# EAGLE design quad-hybrid-QCN-xxx+ (EAGLE 9.5.1)
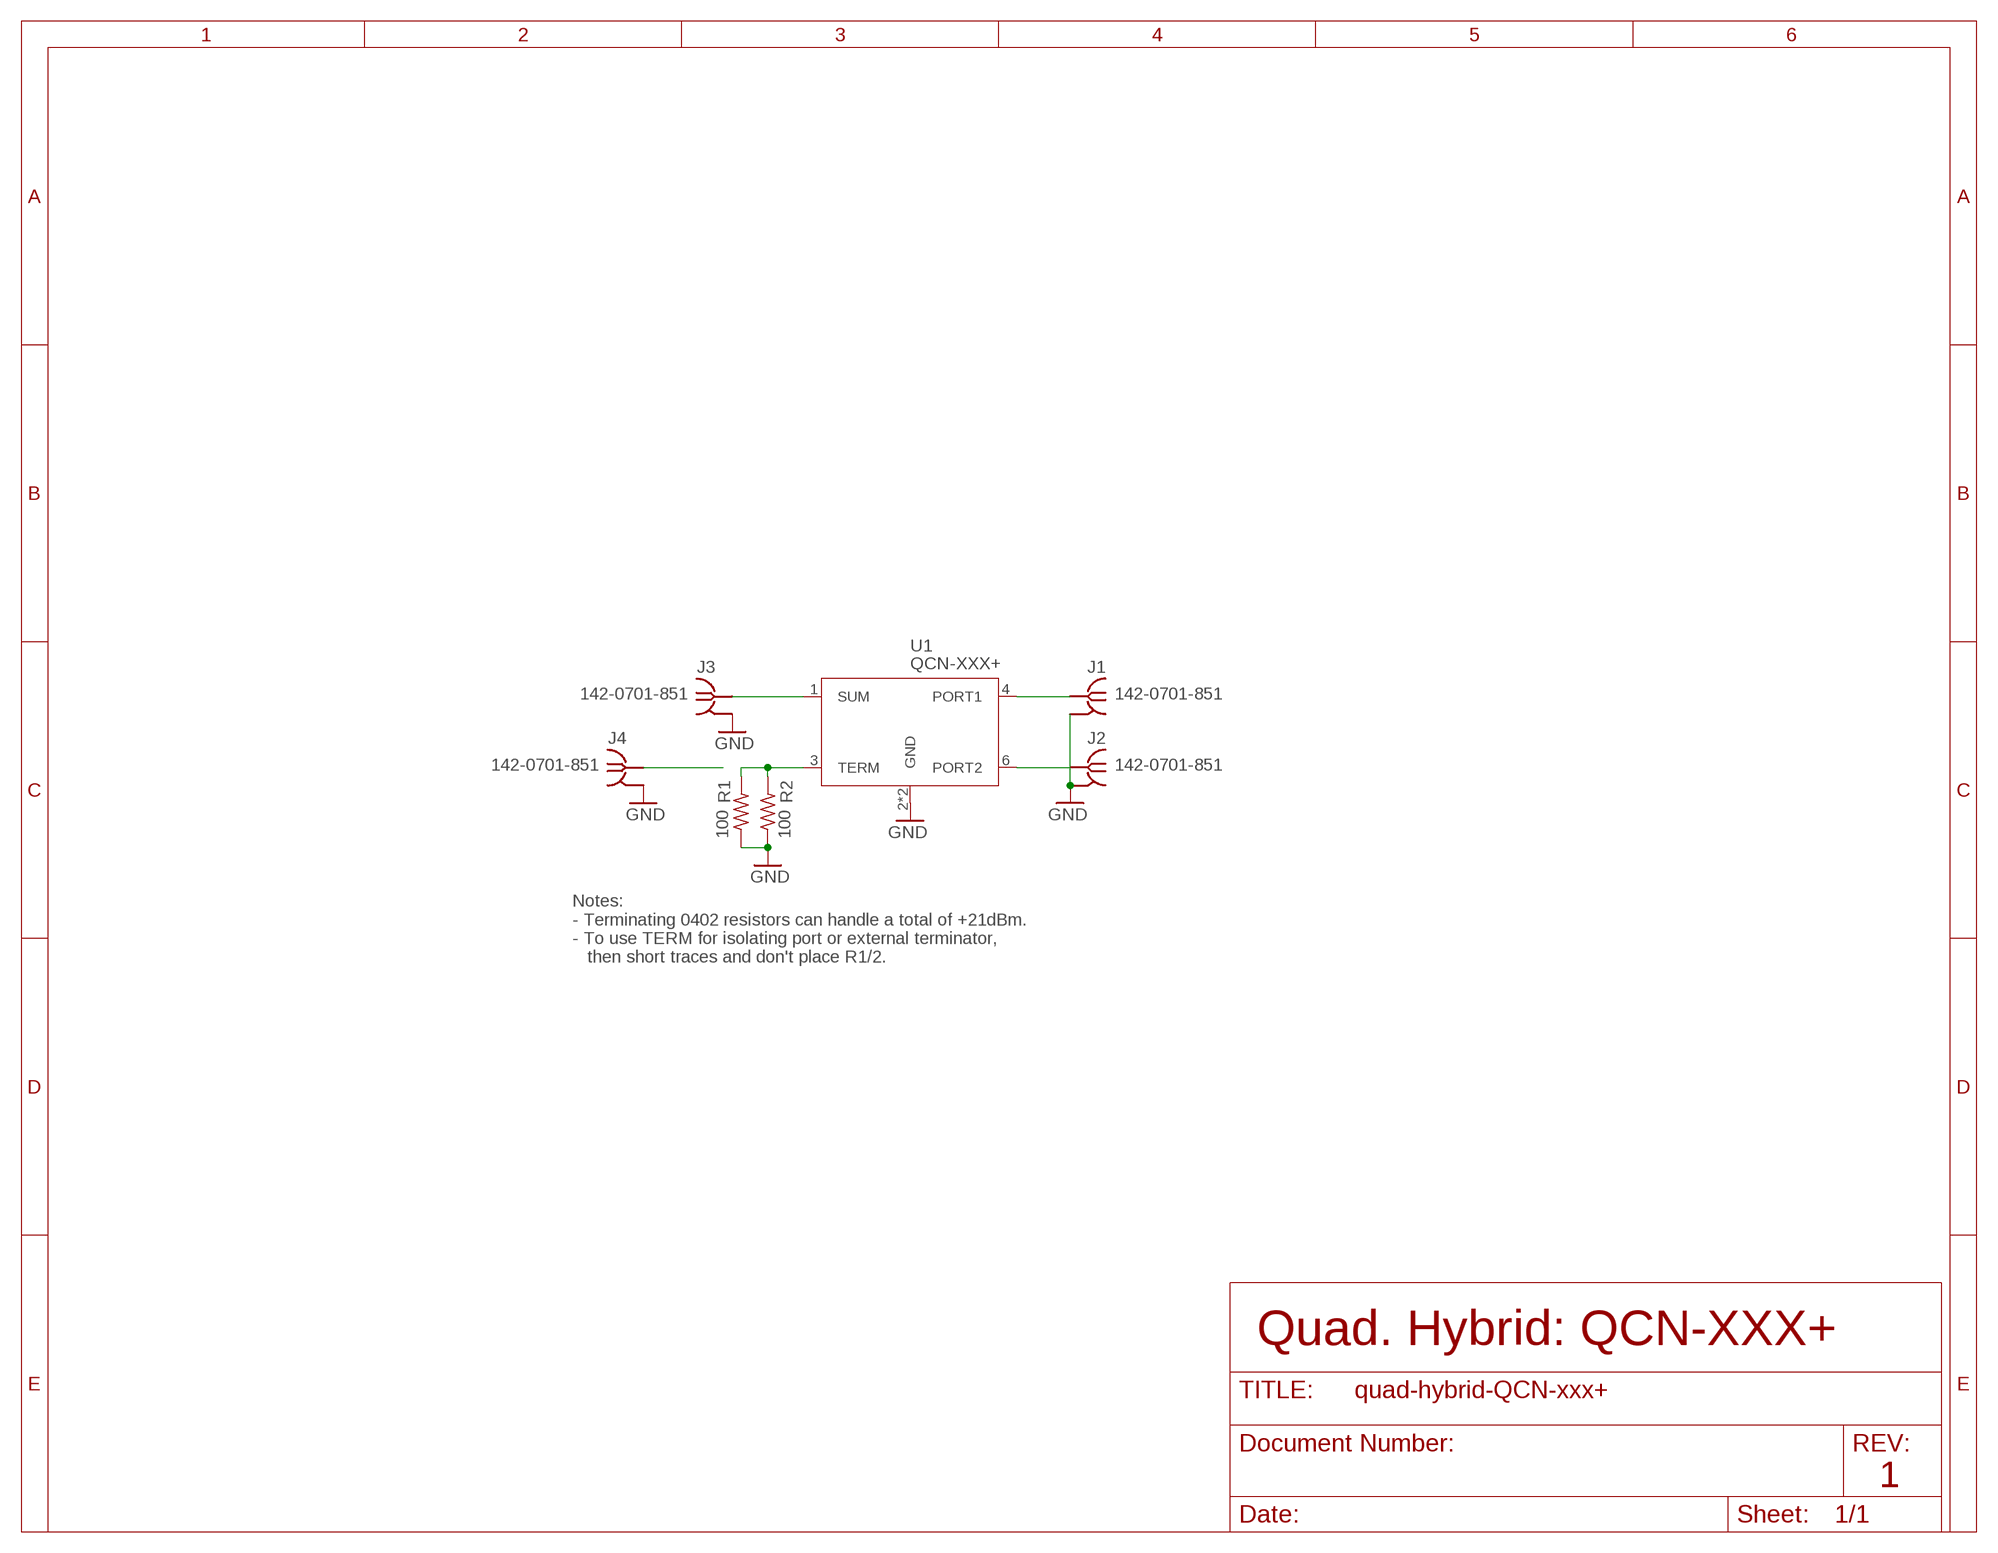
[diagram p0: schematic, sheet 1]

## Parts
J1  142-0701-851  [142-0701-851]
J2  142-0701-851  [142-0701-851]
J3  142-0701-851  [142-0701-851]
J4  142-0701-851  [142-0701-851]
R1  100  R-US_0402-C-NOSILK  [.0402-C-NOSILK]
R2  100  R-US_0402-C-NOSILK  [.0402-C-NOSILK]
U1  QCN-XXX+  [QCN-XXX+]

## Nets
GND: J1.GND1(GND) J1.GND2(GND) J1.GND3(GND) J1.GND4(GND) J2.GND1(GND) J2.GND2(GND) J2.GND3(GND) J2.GND4(GND) J3.GND1(GND) J3.GND2(GND) J3.GND3(GND) J3.GND4(GND) J4.GND1(GND) J4.GND2(GND) J4.GND3(GND) J4.GND4(GND) R1.1 R2.1 U1.2(GND) U1.5(GND)
ISO [RF]: J4.RF1(RF)
P1 [RF]: J1.RF1(RF) U1.4(PORT1)
P2 [RF]: J2.RF1(RF) U1.6(PORT2)
SUM [RF]: J3.RF1(RF) U1.1(SUM)
TERM: R1.2 R2.2 U1.3(TERM)

## Notes on the sheet
- Notes:
  - Terminating 0402 resistors can handle a total of +21dBm.
  - To use TERM for isolating port or external terminator,
     then short traces and don't place R1/2.
- Quad. Hybrid: QCN-XXX+
- 1

## Library data of the parts
J1-J4 = J-Cinch-142-0701-851-SMA-end-launch:142-0701-851: SMA Jack 50Ω - End Launch Source: Datasheet <https://belfuse.com/resources/productinformations/cinchconnectivitysolutions/johnson/pi-ccs-john-142-0701-851.pdf>
R1 R2 = oresat-rcl:R-US_: RESISTOR, American symbol
U1 = U-MiniCirc-QCN-XXX+-quad:QCN-XXX+: RF Power Splitter/Combiner, Quadrature Hybrid QCN-19+ 1100 - 1925 MHz Datasheet: Datasheet <https://www.minicircuits.com/pdfs/QCN-19+.pdf>

## Net classes
1 RF: clearance 0.7 mm

## Board
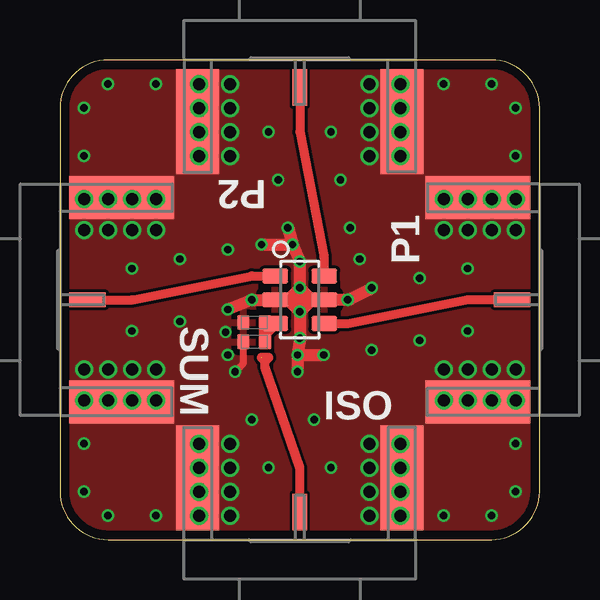
[diagram p1: board, top side]
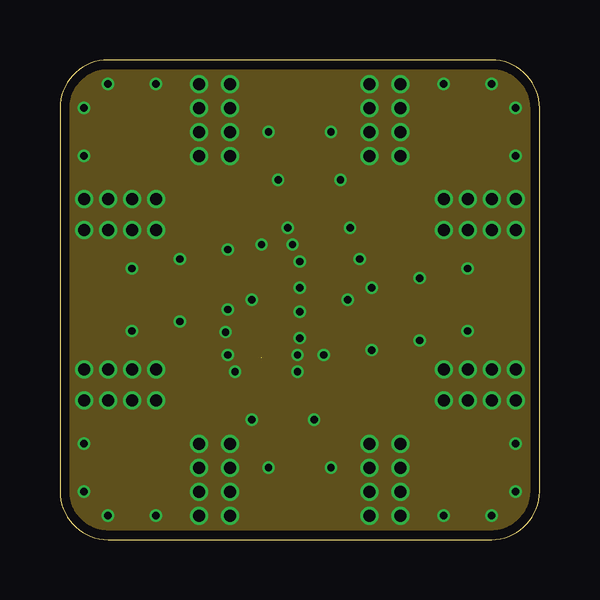
[diagram p2: board, inner layer Route2]
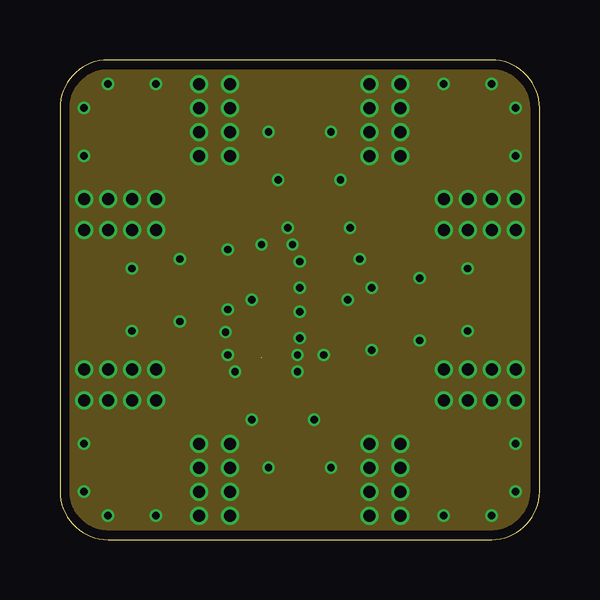
[diagram p3: board, inner layer Route15]
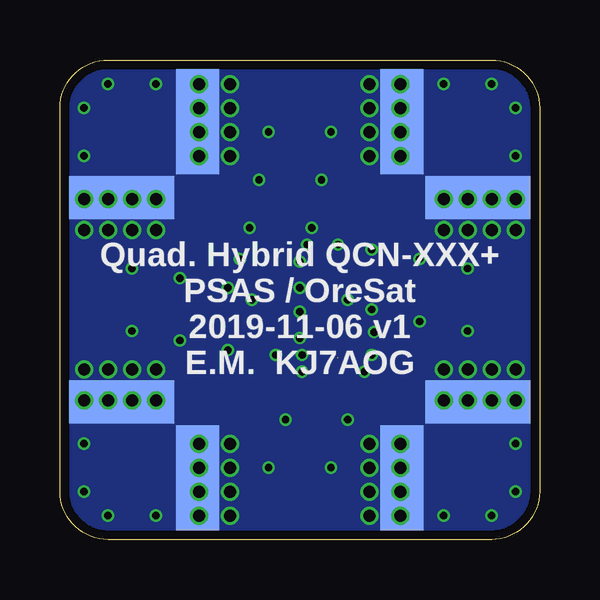
[diagram p4: board, bottom side, seen from below]

Size 20 x 20 mm. Coordinates in mm from the lower left corner, seen from the top.
Outline: 0,18 0,2 arc90 2,0 18,0 arc90 20,2 20,18 arc90 18,20 2,20 arc90 0,18
Copper layers (1*2*15*16): Top 0.035559375mm / dielectric 0.17018125mm / Route2 0.01778125mm / dielectric 47mil / Route15 0.01778125mm / dielectric 0.17018125mm / Bottom 0.035559375mm
Design rules "oshpark-4layer-tented": minimum track width 5mil, minimum drill 10mil, track to track 5mil, track to pad 5mil, pad to pad 5mil, via to via 5mil, smd to smd 5mil, copper to edge 15mil, drill to drill 6mil, minimum pad ring 4mil, minimum via ring 4mil, stop-mask expansion 2.5mil, vias tented up to drill 20mil, thermal gap 10mil

### Footprints (pad centres in the part's own frame; a part is rotated, then mirrored left to right if it is on the bottom)
142-0701-851 = smd 1.8 x 4.37: GND1 -4.255,-2.566; GND2 4.255,-2.566 | smd 1.8 x 4.37 bottom: GND3 -4.255,-2.566; GND4 4.255,-2.566 | smd 0.6 x 1.53: RF1 0,-1.146
.0402-C-NOSILK = smd 0.5 x 0.6: 1 -0.45,0; 2 0.45,0
QCN-XXX+ = smd 0.61 x 1.07: 1 -0.99,-1.025; 2 0,-1.025; 3 0.99,-1.025; 4 0.99,1.025; 5 0,1.025; 6 -0.99,1.025

### Placement (x,y rotation side)
J1  20,10 270 top
J2  10,20 0 top
J3  0,10 90 top
J4  10,0 180 top
R1  8.1,8.25 0 top
R2  8.1,9.05 0 top
U1  10,10 270 top

### Tracks (layer width: path | path; a pad name or v marks a point on that pad's centre or on a via)
GND  (via drill 0.3, 0.5)
  Top 0.3: v7.3,7 7.65,7.35 R1.1
  Top 0.5: U1.2 9.5,10 | 9.5,10 v10,10.5 | U1.5 10.5,10 | 10.5,10 v10,10.5 | U1.2 9.5,10 | 9.5,10 v10,9.5 | U1.5 10.5,10 | 10.5,10 v10,9.5 | U1.2 v8,10 v7,9.6 | U1.5 v12,10 v13,10.5 | v10,10.5 v10,11.6 v9.7,12.3 | v10,9.5 v10,8.4 v9.9,7.7 | U1.2 U1.5 | v9.9,7.7 v9.9,7 | v9.9,7.7 v11,7.7 | v9.5,13 v9.7,12.3 | v8.4,12.3 v9.7,12.3
  other vias: 1,5.8 2,5.8 3,5.8 4,5.8 1,7.1 2,7.1 3,7.1 4,7.1 1,14.2 2,14.2 3,14.2 4,14.2 1,12.9 2,12.9 3,12.9 4,12.9 5.8,4 5.8,3 5.8,2 5.8,1 7.1,1 7.1,2 7.1,3 7.1,4 14.2,4 14.2,3 14.2,2 14.2,1 12.9,1 12.9,2 12.9,3 12.9,4 16,5.8 17,5.8 18,5.8 19,5.8 16,7.1 17,7.1 18,7.1 19,7.1 16,14.2 17,14.2 18,14.2 19,14.2 16,12.9 17,12.9 18,12.9 19,12.9 1,2 2,1 4,1 1,4 18,1 19,2 16,1 19,4 19,18 19,16 18,19 1,18 1,16 2,19 4,19 16,19 3,8.7 3,11.3 17,11.3 17,8.7 8.7,3 11.3,3 5.8,19 5.8,18 5.8,17 5.8,16 7.1,16 7.1,17 7.1,18 7.1,19 12.9,19 12.9,18 12.9,17 12.9,16 14.2,19 14.2,18 14.2,17 14.2,16 5,9.1 5,11.7 7,12.1 6.9,8.65 7,7.7 15,8.3 15,10.9 13,7.9 8.7,17 11.3,17 9.1,15 11.7,15 12.1,13 8,5 10.6,5 12.5,11.7
  pour Top (rank 2): 0,20 20,20 20,0 0,0
  pour Bottom: 0,20 20,20 20,0 0,0
  pour Route2: 0,20 20,20 20,0 0,0
  pour Route15: 0,20 20,20 20,0 0,0
  pour Top (rank 2, no thermals): 0,16 6,16 6,5 14,5 14,16 20,16 20,0 0,0
  pour Bottom (no thermals): 0,16 6,16 6,5 14,5 14,16 20,16 20,0 0,0
  pour Top (no thermals): 4,20 16,20 16,14 4,14
  pour Bottom (no thermals): 4,20 16,20 16,14 4,14
ISO  (1 unrouted)
  Top 0.38: J4.RF1 10,3 8.55,7.2 | 8.55,7.2 8.55,7.43 | 8.55,7.43 8.4,7.58 | 8.55,7.2 8.55,7.43 | 8.55,7.43 8.7,7.58
  Top 0.4: 8.4,7.6 8.7,7.6
P1
  Top 0.38: J1.RF1 17,10 12,9 U1.4
P2
  Top 0.38: J2.RF1 10,17 11,11.8 11,11.02 U1.6
SUM
  Top 0.38: J3.RF1 3,10 8,11 U1.1
TERM
  Top 0.5: R2.2 R1.2 8.55,8.59 U1.3

### Text on the board
tPlace: P2 | P1 | SUM | ISO
bPlace: Quad. Hybrid QCN-XXX+ / PSAS / OreSat / 2019-11-06 v1 / E.M. KJ7AOG